# Altium schematic sheet 03_Mechanicals.SchDoc
size A; ApprovedDate: 04/02/2019; AssemblyNumber: ECE315-F19
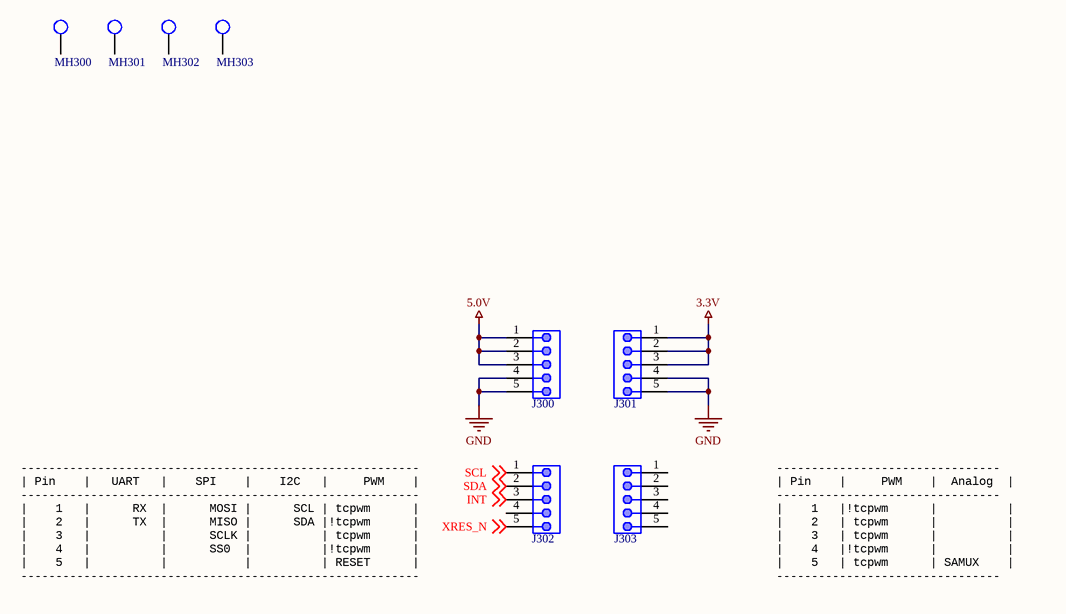
[diagram p0: 03_Mechanicals.SchDoc]

## Parts
J300  CONN_HEADER_MALE_1x5  [HDR1X5]  (value not drawn)
J301  CONN_HEADER_MALE_1x5  [HDR1X5]  (value not drawn)
J302  CONN_HEADER_MALE_1x5  [HDR1X5]  (value not drawn)
J303  CONN_HEADER_MALE_1x5  [HDR1X5]  (value not drawn)
MH300  MHOLE_2_55MM  [MHOLE_2_55MM]  (value not drawn)  (no BOM)
MH301  MHOLE_2_55MM  [MHOLE_2_55MM]  (value not drawn)  (no BOM)
MH302  MHOLE_2_55MM  [MHOLE_2_55MM]  (value not drawn)  (no BOM)
MH303  MHOLE_2_55MM  [MHOLE_2_55MM]  (value not drawn)  (no BOM)

## Nets
3.3V: J301.1 J301.2 J301.3
5.0V: J300.1 J300.2 J300.3
GND: J300.4 J300.5 J301.4 J301.5
INT: J302.3 ; off-sheet INT
SCL: J302.1 ; off-sheet SCL
SDA: J302.2 ; off-sheet SDA
XRES_N: J302.5 ; off-sheet XRES_N

Not connected (* = marked no-connect by the designer): J302 4; J303 1 2 3 4 5; MH300 1; MH301 1; MH302 1; MH303 1

## Notes on the sheet
- ---------------------------------------------------------
  | Pin    |   UART   |    SPI    |    I2C   |     PWM    |
  ---------------------------------------------------------
  |    1   |      RX  |      MOSI |      SCL | tcpwm      |
  |    2   |      TX  |      MISO |      SDA |!tcpwm      |
  |    3   |          |      SCLK |          | tcpwm      |
  |    4   |          |      SS0  |          |!tcpwm      |
  |    5   |          |           |          | RESET      |
  ---------------------------------------------------------
- --------------------------------
  | Pin    |     PWM    |  Analog  |
  --------------------------------
  |    1   |!tcpwm      |          |
  |    2   | tcpwm      |          |
  |    3   | tcpwm      |          |
  |    4   |!tcpwm      |          |
  |    5   | tcpwm      | SAMUX    |
  --------------------------------

## Library data of the parts
J300-J303 = CONN_HEADER_MALE_1x5: Header, 5-Pin; Manufacturer 1: Sullins; Manufacturer Part Number 1: PREC005SACN-RC; Number of Positions: 5; Connector Type: Male Pin; Pitch: 0.1inch; ComponentLink1URL: http://www.farnell.com/cad/1737268.pdf; ComponentLink1Description: http://www.farnell.com/cad/1737268.pdf; ComponentLink2URL: http://katalog.we-online.de/em/datasheet/6130xx11121.pdf; ComponentLink2Description: http://katalog.we-online.de/em/datasheet/6130xx11121.pdf; Supplier 1: Digi-Key; Stock 1: 0; Pricing 1: 1=0.19000, 10=0.17400, 25=0.12960, 50=0.11120, 100=0.10740, 250=0.09264, 500=0.08892 (USD); RoHS: Yes; Mount: Through Hole; Color: Black; Contact Plating: Tin; Package Quantity: 1; Number of Rows: 1; Packaging: Bulk; Termination: Solder; Contact Mating Length: 0.23inch; ComponentLink3URL: https://datasheet.ciiva.com/741/xrxczzzsxxn-rc-st-11635-b-741840.pdf?src-supplier=Digi-Key; ComponentLink3Description: https://datasheet.ciiva.com/741/xrxczzzsxxn-rc-st-11635-b-741840.pdf?src-supplier=Digi-Key; Supplier Part Number 1: S1032EC-05-ND
MH300-MH303 = MHOLE_2_55MM: Mounting Holde; Manufacturer Part Number: UW MTHOLE